# EAGLE design LED_strip_control (EAGLE 6.6.0)
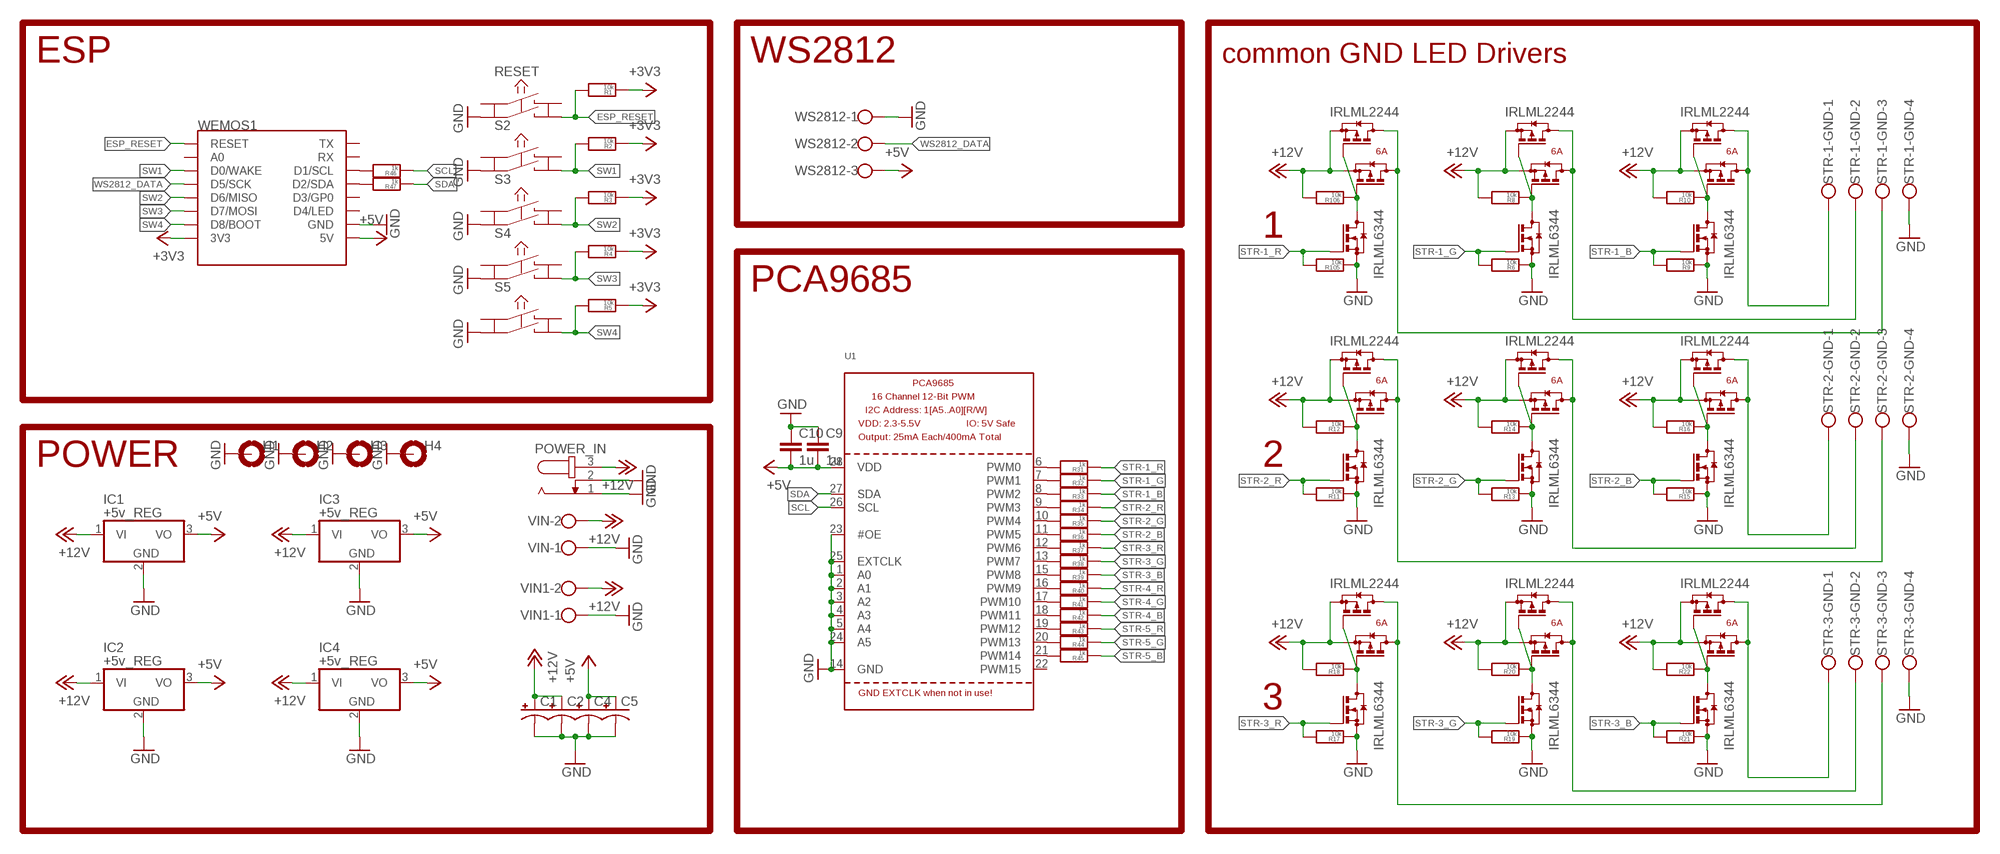
[diagram p0: schematic, sheet 1, part 1 of 2]
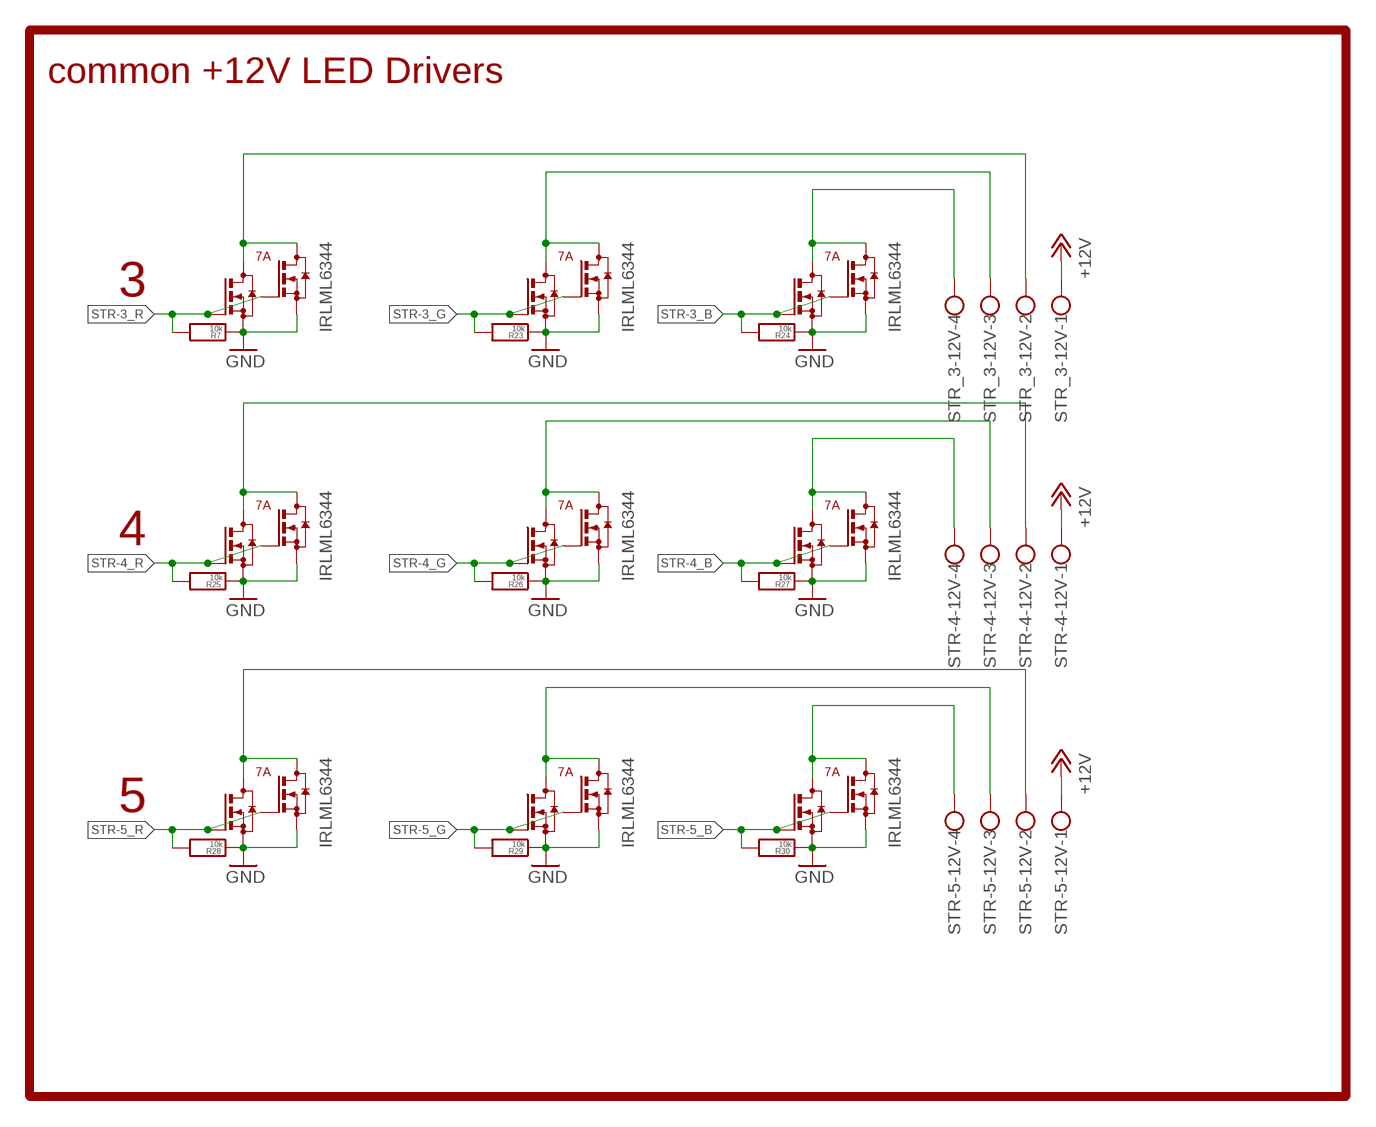
[diagram p1: schematic, sheet 1, part 2 of 2]

## Parts
C1  CPOL-USE5-10.5  [E5-10,5@1]
C2  CPOL-USE5-10.5  [E5-10,5@1]
C4  CPOL-USE5-10.5  [E5-10,5@1]
C5  CPOL-USE5-10.5  [E5-10,5@1]
C9  1u  C-EUC0805  [C0805]
C10  1u  C-EUC0805  [C0805]
H1  MOUNT-PAD-ROUND3.2  [3,2-PAD]
H2  MOUNT-PAD-ROUND3.2  [3,2-PAD]
H3  MOUNT-PAD-ROUND3.2  [3,2-PAD]
H4  MOUNT-PAD-ROUND3.2  [3,2-PAD]
IC1  +5v_REG  786TV  [TO220V]
IC2  +5v_REG  786TV  [TO220V]
IC3  +5v_REG  786TV  [TO220V]
IC4  +5v_REG  786TV  [TO220V]
POWER_IN  RAPC7120  [RAPC712]
Q1  IRLML2244  BSS84  [SOT23]
Q2  IRLML2244  BSS84  [SOT23]
Q3  IRLML6344  BSS123  [SOT23]
Q4  IRLML6344  BSS123  [SOT23]
Q5  IRLML6344  BSS123  [SOT23]
Q6  IRLML6344  BSS123  [SOT23]
Q7  IRLML2244  BSS84  [SOT23]
Q8  IRLML2244  BSS84  [SOT23]
Q9  IRLML6344  BSS123  [SOT23]
Q10  IRLML2244  BSS84  [SOT23]
Q11  IRLML2244  BSS84  [SOT23]
Q12  IRLML6344  BSS123  [SOT23]
Q13  IRLML2244  BSS84  [SOT23]
Q14  IRLML2244  BSS84  [SOT23]
Q15  IRLML6344  BSS123  [SOT23]
Q16  IRLML2244  BSS84  [SOT23]
Q17  IRLML2244  BSS84  [SOT23]
Q18  IRLML6344  BSS123  [SOT23]
Q19  IRLML2244  BSS84  [SOT23]
Q20  IRLML2244  BSS84  [SOT23]
Q21  IRLML6344  BSS123  [SOT23]
Q22  IRLML2244  BSS84  [SOT23]
Q23  IRLML2244  BSS84  [SOT23]
Q24  IRLML6344  BSS123  [SOT23]
Q25  IRLML2244  BSS84  [SOT23]
Q26  IRLML2244  BSS84  [SOT23]
Q27  IRLML6344  BSS123  [SOT23]
Q28  IRLML2244  BSS84  [SOT23]
Q29  IRLML2244  BSS84  [SOT23]
Q30  IRLML6344  BSS123  [SOT23]
Q31  IRLML6344  BSS123  [SOT23]
Q32  IRLML6344  BSS123  [SOT23]
Q33  IRLML6344  BSS123  [SOT23]
Q34  IRLML6344  BSS123  [SOT23]
Q35  IRLML6344  BSS123  [SOT23]
Q36  IRLML6344  BSS123  [SOT23]
Q37  IRLML6344  BSS123  [SOT23]
Q38  IRLML6344  BSS123  [SOT23]
Q39  IRLML6344  BSS123  [SOT23]
Q40  IRLML6344  BSS123  [SOT23]
Q41  IRLML6344  BSS123  [SOT23]
Q42  IRLML6344  BSS123  [SOT23]
Q43  IRLML6344  BSS123  [SOT23]
Q44  IRLML6344  BSS123  [SOT23]
Q45  IRLML6344  BSS123  [SOT23]
R1  10k  R-EU_R0805  [R0805]
R2  10k  R-EU_R0805  [R0805]
R3  10k  R-EU_R0805  [R0805]
R4  10k  R-EU_R0805  [R0805]
R5  10k  R-EU_R0805  [R0805]
R6  10k  R-EU_R0805  [R0805]
R7  10k  R-EU_R0805  [R0805]
R8  10k  R-EU_R0805  [R0805]
R9  10k  R-EU_R0805  [R0805]
R10  10k  R-EU_R0805  [R0805]
R11  10k  R-EU_R0805  [R0805]
R12  10k  R-EU_R0805  [R0805]
R13  10k  R-EU_R0805  [R0805]
R14  10k  R-EU_R0805  [R0805]
R15  10k  R-EU_R0805  [R0805]
R16  10k  R-EU_R0805  [R0805]
R17  10k  R-EU_R0805  [R0805]
R18  10k  R-EU_R0805  [R0805]
R19  10k  R-EU_R0805  [R0805]
R20  10k  R-EU_R0805  [R0805]
R21  10k  R-EU_R0805  [R0805]
R22  10k  R-EU_R0805  [R0805]
R23  10k  R-EU_R0805  [R0805]
R24  10k  R-EU_R0805  [R0805]
R25  10k  R-EU_R0805  [R0805]
R26  10k  R-EU_R0805  [R0805]
R27  10k  R-EU_R0805  [R0805]
R28  10k  R-EU_R0805  [R0805]
R29  10k  R-EU_R0805  [R0805]
R30  10k  R-EU_R0805  [R0805]
R31  1k  R-EU_R0805  [R0805]
R32  1k  R-EU_R0805  [R0805]
R33  1k  R-EU_R0805  [R0805]
R34  1k  R-EU_R0805  [R0805]
R35  1k  R-EU_R0805  [R0805]
R36  1k  R-EU_R0805  [R0805]
R37  1k  R-EU_R0805  [R0805]
R38  1k  R-EU_R0805  [R0805]
R39  1k  R-EU_R0805  [R0805]
R40  1k  R-EU_R0805  [R0805]
R41  1k  R-EU_R0805  [R0805]
R42  1k  R-EU_R0805  [R0805]
R43  1k  R-EU_R0805  [R0805]
R44  1k  R-EU_R0805  [R0805]
R45  1k  R-EU_R0805  [R0805]
R46  1k  R-EU_R0805  [R0805]
R47  1k  R-EU_R0805  [R0805]
R105  10k  R-EU_R0805  [R0805]
R106  10k  R-EU_R0805  [R0805]
RESET  KSM611A  [KSM611A]
S2  KSM611A  [KSM611A]
S3  KSM611A  [KSM611A]
S4  KSM611A  [KSM611A]
S5  KSM611A  [KSM611A]
STR-1-GND  KLEMME_4-PIN  [KLEMME_4-PIN]
STR-2-GND  KLEMME_4-PIN  [KLEMME_4-PIN]
STR-3-GND  KLEMME_4-PIN  [KLEMME_4-PIN]
STR-4-12V  KLEMME_4-PIN  [KLEMME_4-PIN]
STR-5-12V  KLEMME_4-PIN  [KLEMME_4-PIN]
STR_3-12V  KLEMME_4-PIN  [KLEMME_4-PIN]
U1  PCA9685  [TSSOP28]
VIN  W237-102  [W237-102]
VIN1  W237-102  [W237-102]
WEMOS1  WEMOS-D1-MINI  [WEMOS-D1-MINI]
WS2812  KLEMME_3-PIN  [KLEMME_3-PIN]

## Nets
+3V3: R1.1 R2.1 R3.1 R4.1 R5.1 WEMOS1.3V3
+5V: C4.+ C5.+ C9.2 C10.2 IC1.3(VO) IC2.3(VO) IC3.3(VO) IC4.3(VO) U1.28(VDD) WEMOS1.5V WS2812.3
+12V: C1.+ C2.+ IC1.1(VI) IC2.1(VI) IC3.1(VI) IC4.1(VI) POWER_IN.3 Q1.2(S) Q2.2(S) Q7.2(S) Q8.2(S) Q10.2(S) Q11.2(S) Q13.2(S) Q14.2(S) Q16.2(S) Q17.2(S) Q19.2(S) Q20.2(S) Q22.2(S) Q23.2(S) Q25.2(S) Q26.2(S) Q28.2(S) Q29.2(S) R8.2 R10.2 R12.2 R14.2 R16.2 R18.2 R20.2 R22.2 R106.2 STR-4-12V.1 STR-5-12V.1 STR_3-12V.1 VIN1.2 VIN.2
ESP_RESET: R1.2 RESET.D WEMOS1.RESET
GND: C1.- C2.- C4.- C5.- C9.1 C10.1 H1.B3,2(MOUNT) H2.B3,2(MOUNT) H3.B3,2(MOUNT) H4.B3,2(MOUNT) IC1.2(GND) IC2.2(GND) IC3.2(GND) IC4.2(GND) POWER_IN.1 POWER_IN.2 Q3.2(S) Q4.2(S) Q5.2(S) Q6.2(S) Q9.2(S) Q12.2(S) Q15.2(S) Q18.2(S) Q21.2(S) Q24.2(S) Q27.2(S) Q30.2(S) Q31.2(S) Q32.2(S) Q33.2(S) Q34.2(S) Q35.2(S) Q36.2(S) Q37.2(S) Q38.2(S) Q39.2(S) Q40.2(S) Q41.2(S) Q42.2(S) Q43.2(S) Q44.2(S) Q45.2(S) R6.1 R7.1 R9.1 R11.1 R13.1 R15.1 R17.1 R19.1 R21.1 R23.1 R24.1 R25.1 R26.1 R27.1 R28.1 R29.1 R30.1 R105.1 RESET.C S2.C S3.C S4.C S5.C STR-1-GND.4 STR-2-GND.4 STR-3-GND.4 U1.1(A0) U1.2(A1) U1.3(A2) U1.4(A3) U1.5(A4) U1.14(GND) U1.23(#OE) U1.24(A5) U1.25(EXTCLK) VIN1.1 VIN.1 WEMOS1.GND WS2812.1
N$1: Q12.3(D) Q13.1(G) Q14.1(G) R12.1
N$2: Q1.3(D) Q2.3(D) STR-1-GND.3
N$3: Q6.3(D) Q7.1(G) Q8.1(G) R8.1
N$4: Q3.3(D) Q5.3(D) STR_3-12V.2
N$5: Q34.3(D) Q35.3(D) STR-4-12V.2
N$6: Q13.3(D) Q14.3(D) STR-2-GND.3
N$7: Q7.3(D) Q8.3(D) STR-1-GND.2
N$8: Q9.3(D) Q10.1(G) Q11.1(G) R10.1
N$9: Q15.3(D) Q16.1(G) Q17.1(G) R14.1
N$10: Q10.3(D) Q11.3(D) STR-1-GND.1
N$11: Q16.3(D) Q17.3(D) STR-2-GND.2
N$12: Q18.3(D) Q19.1(G) Q20.1(G) R16.1
N$13: Q19.3(D) Q20.3(D) STR-2-GND.1
N$14: Q21.3(D) Q22.1(G) Q23.1(G) R18.1
N$15: Q22.3(D) Q23.3(D) STR-3-GND.3
N$16: Q24.3(D) Q25.1(G) Q26.1(G) R20.1
N$17: Q25.3(D) Q26.3(D) STR-3-GND.2
N$18: Q27.3(D) Q28.1(G) Q29.1(G) R22.1
N$19: Q28.3(D) Q29.3(D) STR-3-GND.1
N$20: Q30.3(D) Q31.3(D) STR_3-12V.3
N$21: Q36.3(D) Q37.3(D) STR-4-12V.3
N$22: Q32.3(D) Q33.3(D) STR_3-12V.4
N$23: Q38.3(D) Q39.3(D) STR-4-12V.4
N$24: Q40.3(D) Q41.3(D) STR-5-12V.2
N$25: Q42.3(D) Q43.3(D) STR-5-12V.3
N$26: Q44.3(D) Q45.3(D) STR-5-12V.4
N$27: R31.2 U1.6(PWM0)
N$28: R32.2 U1.7(PWM1)
N$29: R45.2 U1.21(PWM14)
N$30: R44.2 U1.20(PWM13)
N$31: R43.2 U1.19(PWM12)
N$32: R42.2 U1.18(PWM11)
N$33: R41.2 U1.17(PWM10)
N$34: R40.2 U1.16(PWM9)
N$35: R39.2 U1.15(PWM8)
N$36: R38.2 U1.13(PWM7)
N$37: R37.2 U1.12(PWM6)
N$38: R36.2 U1.11(PWM5)
N$39: R35.2 U1.10(PWM4)
N$40: R34.2 U1.9(PWM3)
N$41: R33.2 U1.8(PWM2)
N$42: R46.2 WEMOS1.D1(D1/SCL)
N$43: R47.2 WEMOS1.D2(D2/SDA)
N$115: Q1.1(G) Q2.1(G) Q4.3(D) R106.1
SCL: R46.1 U1.26(SCL)
SDA: R47.1 U1.27(SDA)
STR-1_B: Q9.1(G) R9.2 R33.1
STR-1_G: Q6.1(G) R6.2 R32.1
STR-1_R: Q4.1(G) R31.1 R105.2
STR-2_B: Q18.1(G) R15.2 R36.1
STR-2_G: Q15.1(G) R13.2 R35.1
STR-2_R: Q12.1(G) R11.2 R34.1
STR-3_B: Q27.1(G) Q32.1(G) Q33.1(G) R21.2 R24.2 R39.1
STR-3_G: Q24.1(G) Q30.1(G) Q31.1(G) R19.2 R23.2 R38.1
STR-3_R: Q3.1(G) Q5.1(G) Q21.1(G) R7.2 R17.2 R37.1
STR-4_B: Q38.1(G) Q39.1(G) R27.2 R42.1
STR-4_G: Q36.1(G) Q37.1(G) R26.2 R41.1
STR-4_R: Q34.1(G) Q35.1(G) R25.2 R40.1
STR-5_B: Q44.1(G) Q45.1(G) R30.2 R45.1
STR-5_G: Q42.1(G) Q43.1(G) R29.2 R44.1
STR-5_R: Q40.1(G) Q41.1(G) R28.2 R43.1
SW1: R2.2 S2.D WEMOS1.D0(D0/WAKE)
SW2: R3.2 S3.D WEMOS1.D6(D6/MISO)
SW3: R4.2 S4.D WEMOS1.D7(D7/MOSI)
SW4: R5.2 S5.D WEMOS1.D8(D8/BOOT)
WS2812_DATA: WEMOS1.D5(D5/SCK) WS2812.2
Unconnected: RESET.A RESET.B S2.A S2.B S3.A S3.B S4.A S4.B S5.A S5.B U1.22(PWM15) WEMOS1.A0 WEMOS1.D3(D3/GP0) WEMOS1.D4(D4/LED) WEMOS1.RX WEMOS1.TX

## Notes on the sheet
- ESP | WS2812 | common GND LED Drivers | common +12V LED Drivers
- 6A | 6A | 6A
- 7A | 7A | 7A
- 3
- 1
- PCA9685
- 6A | 6A | 6A
- 7A | 7A | 7A
- 4
- POWER | 2
- 7A | 7A | 7A
- 5
- 6A | 6A | 6A
- 3

## Library data of the parts
C1 C2 C4 C5 = rcl:CPOL-US: POLARIZED CAPACITOR, American symbol
C9 C10 = rcl:C-EU: CAPACITOR, European symbol
H1-H4 = holes:MOUNT-PAD-ROUND: MOUNTING PAD, round
IC1-IC4 = linear:78*: Positive VOLTAGE REGULATOR Source: http://cache.national.com/ds/LM/LM78L05.pdf http://www.fairchildsemi.com/ds/LM/LM7805.pdf
POWER_IN = Arduino Mega 2560:RAPC712: DC POWER JACK Power Jack, DC, Right Angle, Through Hole, Rated 5A at 16VDC, PC Terminals Distributor: Farnell (www.Farnell.de) Drawing: 84N1161.pdf / 84N1162.pdf Manufacturer: SPC Technology (www.spctechnology.com) Type: SPC4077 / SPC 4078
Q1 Q2 Q7 Q8 Q10 Q11 Q13 Q14 Q16 Q17 Q19 Q20 Q22 Q23 Q25 Q26 Q28 Q29 = transistor-small-signal:BSS84: P-CHANNEL MOS FET
Q3-Q6 Q9 Q12 Q15 Q18 Q21 Q24 Q27 Q30-Q45 = transistor-small-signal:BSS123: N-CHANNEL MOS FET
R1-R47 R105 R106 = rcl:R-EU_: RESISTOR, European symbol
RESET S2-S5 = schalter_taster:KSM611A
STR-1-GND STR-2-GND STR-3-GND STR-4-12V STR-5-12V STR_3-12V = Schraubklemme:KLEMME_4-PIN
U1 = adafruit:PCA9685: PCA9685 - 16 Channel 12-Bit I2C PWM Controller 5.0V tolerant 16 channel, 12-bit I2C PWM controller with 25mA per output (max. 400mA total) Digikey: 568-5931-1-ND
VIN VIN1 = Schraubklemme:W237-102: WAGO SCREW CLAMP; MPN: 237-102; OC_FARNELL: unknown; OC_NEWARK: 70K9898
WEMOS1 = esp8266modules:WEMOS-D1-MINI: WeMos.cc D1 mini ESP8266 module
WS2812 = Schraubklemme:KLEMME_3-PIN

## Net classes
1 5v: width 0.813 mm, drill 0.8 mm
2 power: width 0.406 mm, drill 0.5 mm, clearance 0.15 mm

## Board
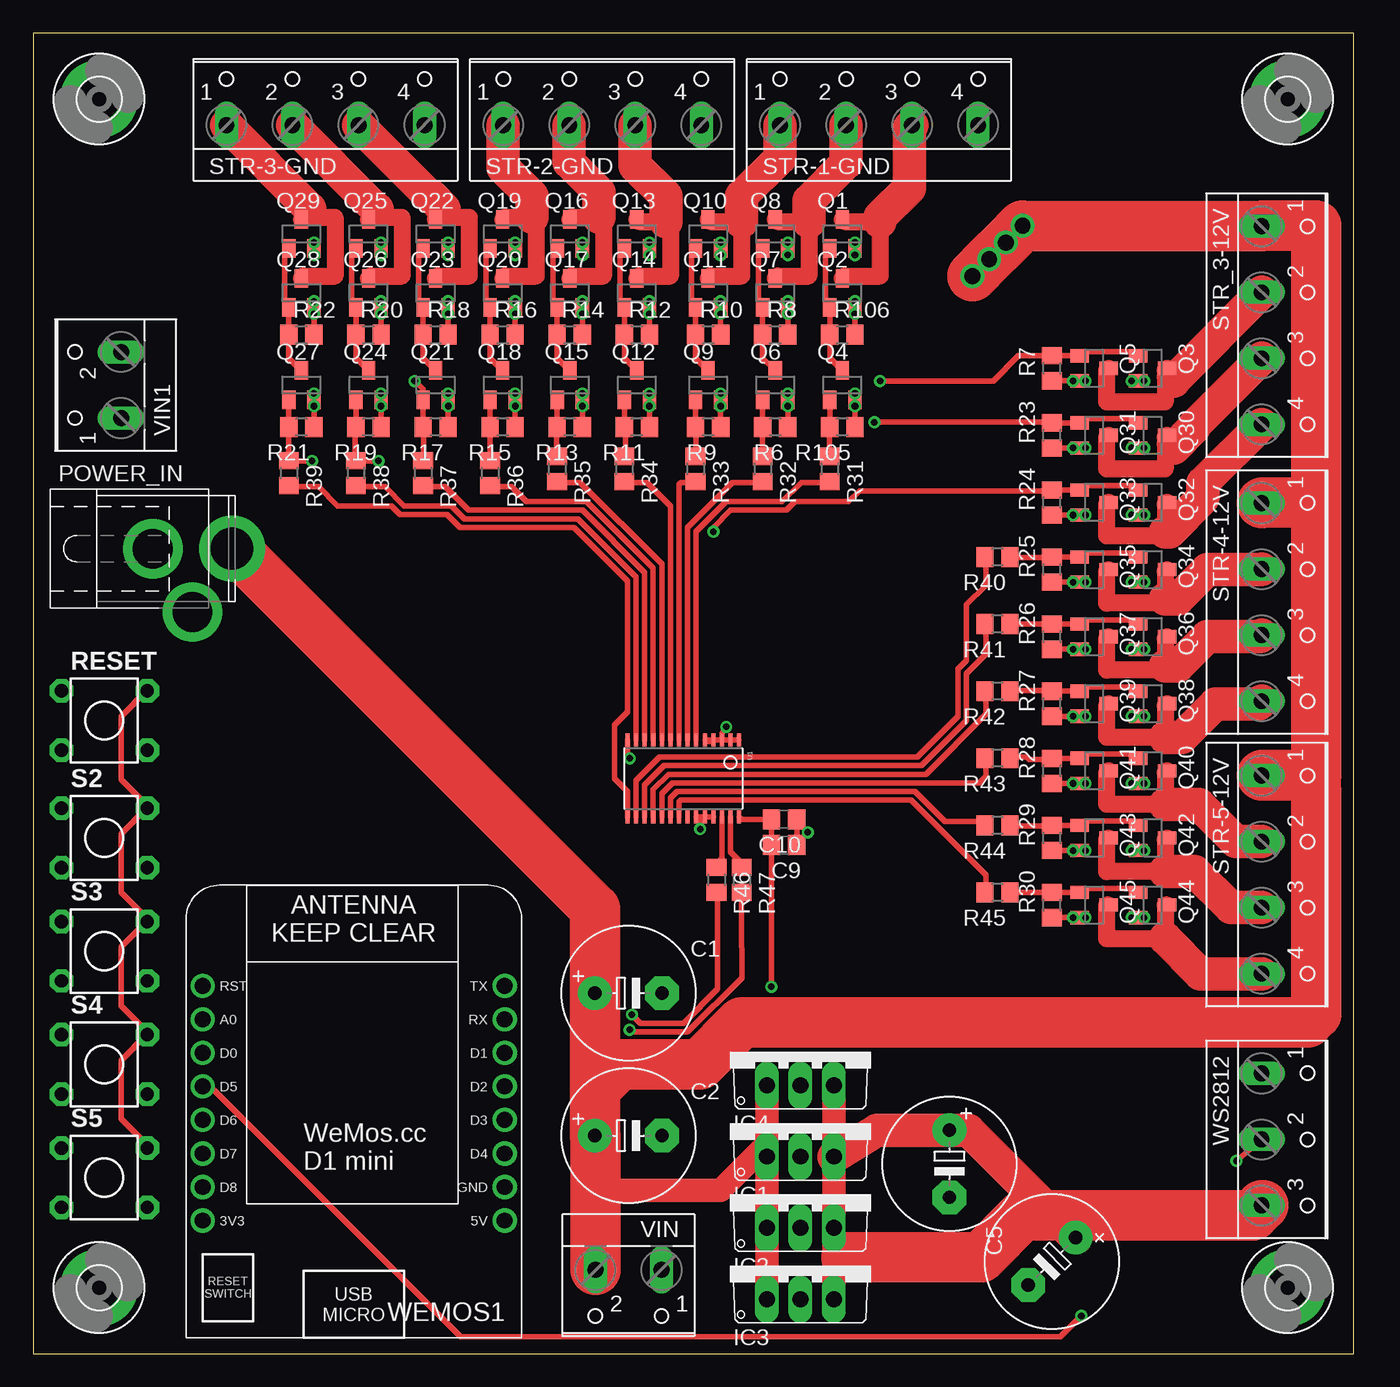
[diagram p2: board, top side]
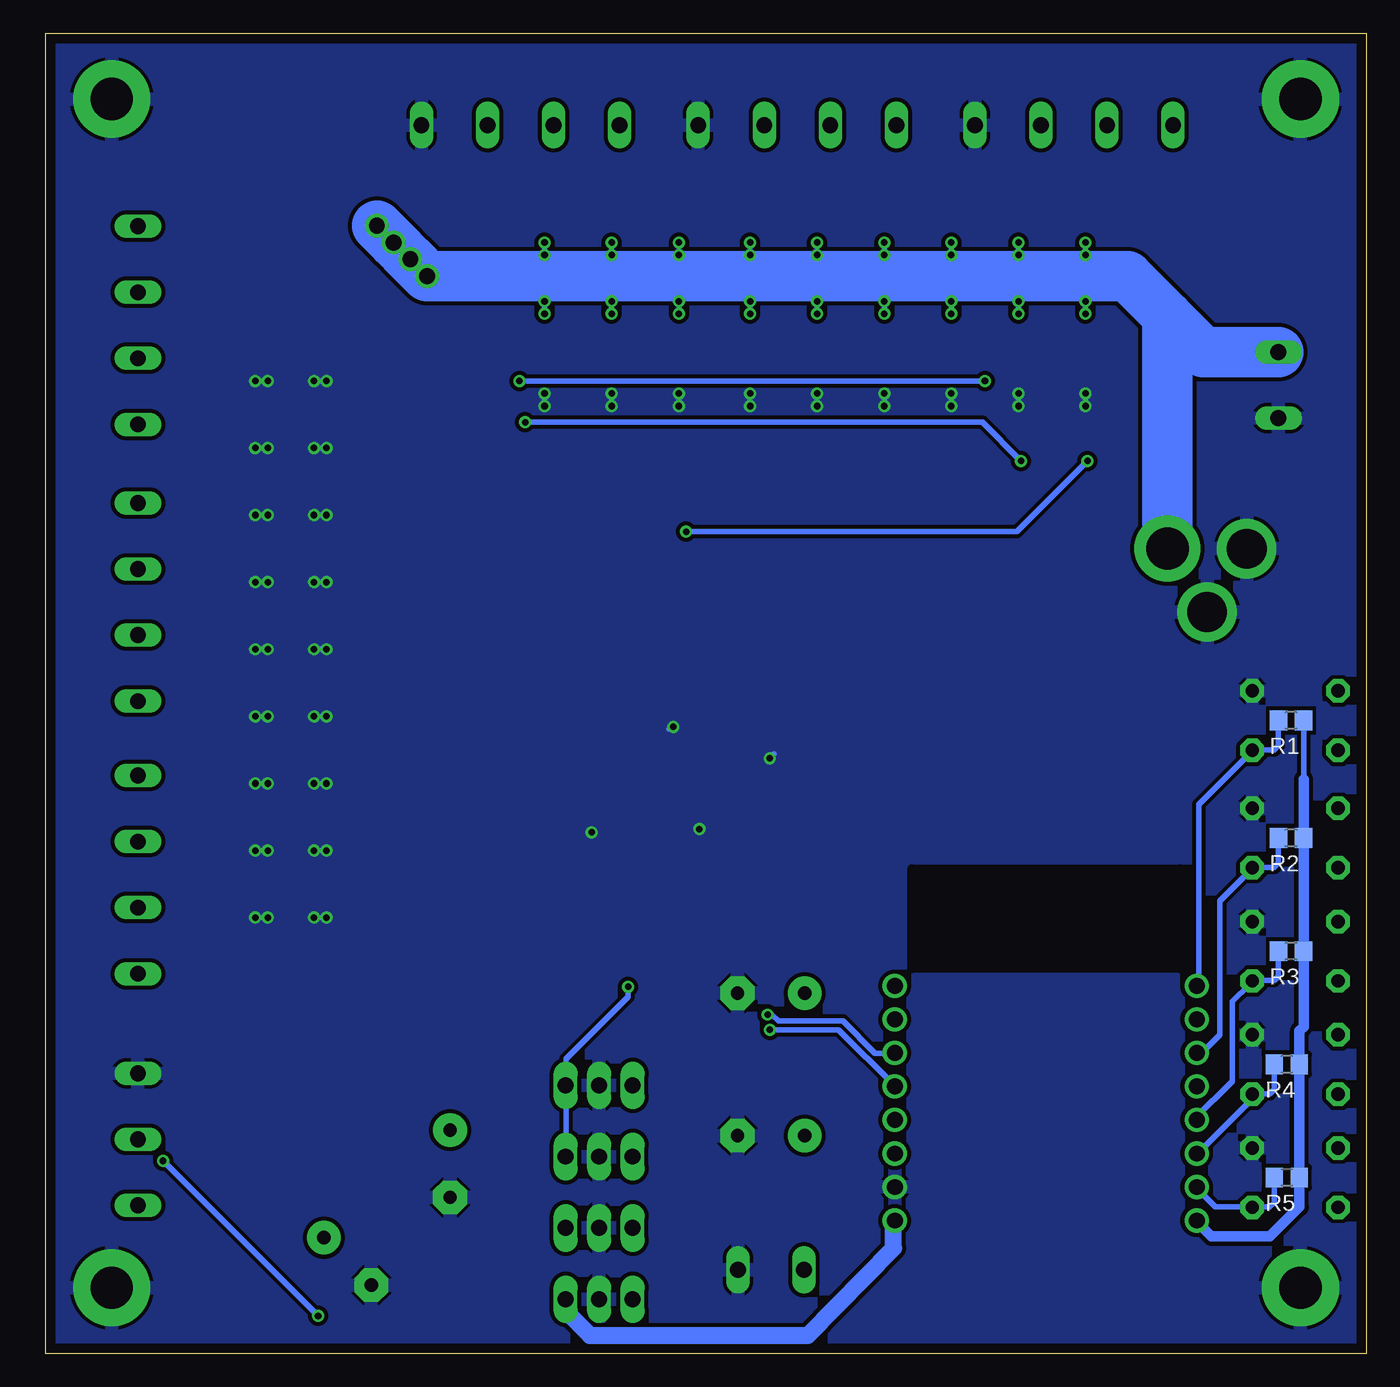
[diagram p3: board, bottom side, seen from below]

Size 100 x 100 mm. Coordinates in mm from the lower left corner, seen from the top.
Outline: 0,0 100,0 100,100 0,100 0,0
Copper layers (1*16): Top 0.035mm / dielectric 1.5mm / Bottom 0.035mm
Design rules "default *": minimum track width 10mil, minimum drill 19mil, track to track 8mil, track to pad 8mil, pad to pad 8mil, via to via 8mil, smd to smd 0mil, copper to edge 30mil, drill to drill 8mil, minimum pad ring 10mil, minimum via ring 8mil, stop-mask expansion 4mil, vias tented up to drill 25mil, thermal gap 10mil

### Footprints (pad centres in the part's own frame; a part is rotated, then mirrored left to right if it is on the bottom)
E5-10,5@1 = drill 1.016 pad 2.54: + -2.54,0 | drill 1.016 pad 2.54 octagon: - 2.54,0
C0805 = smd 1.3 x 1.5: 1 -0.95,0; 2 0.95,0
3,2-PAD = drill 3.2 pad 5.842: B3,2 0,0
TO220V = drill 1.2 long: 1 -2.54,-2.54; 2 0,-2.54; 3 2.54,-2.54
RAPC712 = drill 3 pad 4.5: 1 -3,0; 2 0,-4.8 | drill 3.2 pad 5: 3 3,0
SOT23 = smd 1 x 1.4: 1 -0.95,-1.1; 2 0.95,-1.1; 3 0,1.1
R0805 = smd 1.3 x 1.5: 1 -0.95,0; 2 0.95,0
KSM611A = drill 1.016 pad 1.778 octagon: A -3.25,2.25; B -3.25,-2.25; C 3.25,2.25; D 3.25,-2.25
KLEMME_4-PIN = drill 1.194 long: 1 -2.5,0; 2 2.5,0; 3 7.5,0; 4 12.5,0
TSSOP28 = smd 0.305 x 0.991: 1 -4.225,-2.918; 2 -3.575,-2.918; 3 -2.925,-2.918; 4 -2.275,-2.918; 5 -1.625,-2.918; 6 -0.975,-2.918; 7 -0.325,-2.918; 8 0.325,-2.918; 9 0.975,-2.918; 10 1.625,-2.918; 11 2.275,-2.918; 12 2.925,-2.918; 13 3.575,-2.918; 14 4.225,-2.918; 15 4.225,2.918; 16 3.575,2.918; 17 2.925,2.918; 18 2.275,2.918; 19 1.625,2.918; 20 0.975,2.918; 21 0.325,2.918; 22 -0.325,2.918; 23 -0.975,2.918; 24 -1.625,2.918; 25 -2.275,2.918; 26 -2.925,2.918; 27 -3.575,2.918; 28 -4.225,2.918
W237-102 = drill 1.194 long: 1 -2.5,-1.27; 2 2.5,-1.27
WEMOS-D1-MINI = drill 1.2 pad 1.829: 3V3 -10.16,-10.16; 5V 12.7,-10.16; A0 -10.16,5.08; D0 -10.16,2.54; D1 12.7,2.54; D2 12.7,0; D3 12.7,-2.54; D4 12.7,-5.08; D5 -10.16,0; D6 -10.16,-2.54; D7 -10.16,-5.08; D8 -10.16,-7.62; GND 12.7,-7.62; RESET -10.16,7.62; RX 12.7,5.08; TX 12.7,7.62
KLEMME_3-PIN = drill 1.194 long: 1 -2.5,0; 2 2.5,0; 3 7.5,0

### Placement (x,y rotation side)
C1  45.09,27.3 0 top
C2  45.09,16.51 0 top
C4  77.15,6.99 225 top
C5  69.39,14.38 270 top
C9  56.88,38.51 180 top
C10  56.88,40.46 180 top
H1  5,5 0 top
H2  95,5 0 top
H3  5,95 0 top
H4  95,95 0 top
IC1  58.1,17.46 0 top
IC2  58.1,12.06 0 top
IC3  58.1,6.67 0 top
IC4  58.1,22.86 0 top
POWER_IN  12.06,60.96 0 top
Q1  61.28,84.77 0 top
Q2  61.28,80.33 0 top
Q3  84.77,74.61 270 top
Q4  61.28,73.34 0 top
Q5  80.33,74.61 270 top
Q6  56.2,73.34 0 top
Q7  56.2,80.33 0 top
Q8  56.2,84.77 0 top
Q9  51.12,73.34 0 top
Q10  51.12,84.77 0 top
Q11  51.12,80.33 0 top
Q12  45.72,73.34 0 top
Q13  45.72,84.77 0 top
Q14  45.72,80.33 0 top
Q15  40.64,73.34 0 top
Q16  40.64,84.77 0 top
Q17  40.64,80.33 0 top
Q18  35.56,73.34 0 top
Q19  35.56,84.77 0 top
Q20  35.56,80.33 0 top
Q21  30.48,73.34 0 top
Q22  30.48,84.77 0 top
Q23  30.48,80.33 0 top
Q24  25.4,73.34 0 top
Q25  25.4,84.77 0 top
Q26  25.4,80.33 0 top
Q27  20.32,73.34 0 top
Q28  20.32,80.33 0 top
Q29  20.32,84.77 0 top
Q30  84.77,69.53 270 top
Q31  80.33,69.53 270 top
Q32  84.77,64.45 270 top
Q33  80.33,64.45 270 top
Q34  84.77,59.37 270 top
Q35  80.33,59.37 270 top
Q36  84.77,54.29 270 top
Q37  80.33,54.29 270 top
Q38  84.77,49.21 270 top
Q39  80.33,49.21 270 top
Q40  84.77,44.13 270 top
Q41  80.33,44.13 270 top
Q42  84.77,39.05 270 top
Q43  80.33,39.05 270 top
Q44  84.77,33.97 270 top
Q45  80.33,33.97 270 top
R1  5.71,47.94 180 bottom
R2  5.71,39.05 180 bottom
R3  5.71,30.48 180 bottom
R4  6.03,21.91 180 bottom
R5  6.03,13.34 180 bottom
R6  56.2,70.17 180 top
R7  77.15,74.61 90 top
R8  56.2,77.15 0 top
R9  51.12,70.17 180 top
R10  51.12,77.15 0 top
R11  45.72,70.17 180 top
R12  45.72,77.15 0 top
R13  40.64,70.17 180 top
R14  40.64,77.15 0 top
R15  35.56,70.17 180 top
R16  35.56,77.15 0 top
R17  30.48,70.17 180 top
R18  30.48,77.15 0 top
R19  25.4,70.17 180 top
R20  25.4,77.15 0 top
R21  20.32,70.17 180 top
R22  20.32,77.15 0 top
R23  77.15,69.53 90 top
R24  77.15,64.45 90 top
R25  77.15,59.37 90 top
R26  77.15,54.29 90 top
R27  77.15,49.21 90 top
R28  77.15,44.13 90 top
R29  77.15,39.05 90 top
R30  77.15,33.97 90 top
R31  60.33,66.99 270 top
R32  55.24,66.99 270 top
R33  50.16,66.99 270 top
R34  44.77,66.99 270 top
R35  39.69,66.99 270 top
R36  34.61,66.67 270 top
R37  29.53,66.67 270 top
R38  24.45,66.67 270 top
R39  19.37,66.67 270 top
R40  73.03,60.33 180 top
R41  73.03,55.24 180 top
R42  73.03,50.16 180 top
R43  73.03,45.09 180 top
R44  73.03,40.01 180 top
R45  73.03,34.92 180 top
R46  51.75,35.88 270 top
R47  53.66,35.88 270 top
R105  61.28,70.17 180 top
R106  61.28,77.15 0 top
RESET  5.4,47.94 0 top
S2  5.4,39.05 0 top
S3  5.4,30.48 0 top
S4  5.4,21.91 0 top
S5  5.4,13.34 0 top
STR-1-GND  59.05,93.03 0 top
STR-2-GND  38.1,93.03 0 top
STR-3-GND  17.14,93.03 0 top
STR-4-12V  93.03,61.91 270 top
STR-5-12V  93.03,41.27 270 top
STR_3-12V  93.03,82.87 270 top
U1  49.24,43.55 180 top
VIN  45.09,5.08 180 top
VIN1  5.4,73.34 90 top
WEMOS1  23.02,20.24 0 top
WS2812  93.03,18.73 270 top

### Tracks (layer width: path | path; a pad name or v marks a point on that pad's centre or on a via)
+3V3
  Bottom 0.406: 4.76,43.5 R1.1 | R2.1 | R3.1 | R4.1 | R5.1
  Bottom 0.813: 4.76,43.5 R2.1 R3.1 4.76,24.77 5.08,24.45 R4.1 R5.1 5.08,11.11 7.3,8.89 11.75,8.89 12.7,9.84 WEMOS1.3V3
+5V  (via drill 0.5)
  Top 0.406: U1.28 53.63,40.46 C10.2 C9.2 55.9,38.35 v55.9,27.79
  Top 1.27: 61.59,7.3 60.64,8.26
  Top 1.778: IC3.3 60.64,8.26 IC2.3 IC1.3 | IC1.3 60.73,16.92 | IC4.3 IC1.3
  Top 2.54: IC1.3 63.91,16.92 C5.+ 70.81,16.92 C4.+
  Top 3.81: WS2812.3 93.15,11.23 92.39,10.48 74.93,10.48 71.75,7.3 61.59,7.3
  Bottom 0.406: v55.9,27.79 55.9,27.02 60.61,22.31 60.61,16.9 IC1.3
  Bottom 1.27: WEMOS1.5V 35.81,10.03 35.81,8 42.29,1.4 58.8,1.4 60.58,3.17 60.58,4.06 IC3.3
+12V  (via drill 0.5, 1.2)
  Top 0.406: R106.2 Q2.2 v62.23,78.74 | R8.2 Q7.2 v57.15,78.74 | R10.2 Q11.2 v52.07,78.74 | R12.2 Q14.2 v46.67,78.74 | R14.2 Q17.2 v41.59,78.74 | R16.2 Q20.2 v36.51,78.74 | R18.2 Q23.2 v31.43,78.74 | R20.2 Q26.2 v26.35,78.74 | R22.2 Q28.2 v21.27,78.74 | v21.27,79.69 21.27,79.38 | v26.35,79.69 26.35,79.38 | v31.43,79.69 31.43,79.38 | v36.51,79.69 36.51,79.38 | v41.59,79.69 41.59,79.38 | v46.67,79.69 46.67,79.38 | v52.07,79.69 52.07,79.38 | v57.15,79.69 57.15,79.38 | v62.23,79.69 62.23,79.38 | Q29.2 v21.27,83.19 | v21.27,84.14 21.27,83.82 | Q25.2 v26.35,83.19 | v26.35,84.14 26.35,83.82 | Q22.2 v31.43,83.19 | v31.43,84.14 31.43,83.82 | Q19.2 v36.51,83.19 | v36.51,84.14 36.51,83.82 | Q16.2 v41.59,83.19 | v41.59,84.14 41.59,83.82 | Q13.2 v46.67,83.19 | v46.67,84.14 46.67,83.82 | Q10.2 v52.07,83.19 | v52.07,84.14 52.07,83.82 | Q8.2 v57.15,83.19 | v57.15,84.14 57.15,83.82 | Q1.2 v62.23,83.19 | v62.23,84.14 62.23,83.82
  Top 1.778: IC1.1 IC2.1 IC3.1 | IC1.1 55.56,15.88 52.07,12.38 42.9,12.38 42.59,12.7 | IC4.1 IC1.1
  Top 3.81: STR-4-12V.1 93.07,64.45 97.16,64.45 | 97.16,64.45 97.16,85.41 93.07,85.41 STR_3-12V.1 74.89,85.37 v74.93,85.41 v73.66,84.14 v72.39,82.87 v71.12,81.6 | 97.16,43.81 93.07,43.81 STR-5-12V.1 97.11,43.77 | 97.16,43.81 97.16,64.45 | 42.55,20 C2.+ 42.59,16.47 42.59,12.7 VIN.2 | 97.11,43.77 97.16,43.81 | 97.11,43.77 97.16,41.91 97.16,25.72 96.52,25.08 53.66,25.08 50.48,21.91 44.45,21.91 42.55,20 | 42.55,20 C1.+ 42.55,33.67 15.11,61.1
  Bottom 0.406: v21.27,78.74 v21.27,79.69 21.59,81.6 | v26.35,78.74 v26.35,79.69 26.67,81.6 v26.35,83.19 v26.35,84.14 | v31.43,78.74 v31.43,79.69 31.75,81.6 v31.43,83.19 v31.43,84.14 | v36.51,78.74 v36.51,79.69 36.83,81.6 v36.51,83.19 v36.51,84.14 | v41.59,78.74 v41.59,79.69 41.91,81.6 v41.59,83.19 v41.59,84.14 | v46.67,78.74 v46.67,79.69 46.99,81.6 v46.67,83.19 v46.67,84.14 | v52.07,78.74 v52.07,79.69 52.39,81.6 v52.07,83.19 v52.07,84.14 | v62.23,78.74 v62.23,79.69 62.23,81.6 v62.23,83.19 v62.23,84.14 | v21.27,84.14 v21.27,83.19 21.27,81.6 | v57.15,84.14 v57.15,83.19 57.15,81.6 v57.15,79.69 v57.15,78.74
  Bottom 3.81: v71.12,81.6 v72.39,82.87 | v73.66,84.14 73.98,84.45 | v74.93,85.41 v71.12,81.6 | v71.12,81.6 62.23,81.6 57.15,81.6 52.39,81.6 46.99,81.6 41.91,81.6 36.83,81.6 31.75,81.6 26.67,81.6 21.59,81.6 21.27,81.6 18.1,81.6 15.06,78.56 | POWER_IN.3 15.06,78.56 | VIN1.2 12.34,75.84 15.06,78.56
ESP_RESET
  Bottom 0.406: R1.2 6.67,46.04 6.99,45.72 8.57,45.72 RESET.D 8.89,45.4 12.7,41.59 12.7,27.94 WEMOS1.RESET
GND  (via drill 0.5)
  Top 0.406: R30.1 Q45.2 v78.74,33.02 | R7.1 Q5.2 v78.74,73.66 | R23.1 Q31.2 v78.74,68.58 | R24.1 Q33.2 v78.74,63.5 | R25.1 Q35.2 v78.74,58.42 | R26.1 Q37.2 v78.74,53.34 | R27.1 Q39.2 v78.74,48.26 | R28.1 Q41.2 v78.74,43.18 | R29.1 Q43.2 | Q43.2 79.06,37.93 | Q42.2 v83.19,38.1 | v84.14,38.1 83.82,38.1 | Q43.2 v78.74,38.1 | v79.69,38.1 79.38,38.1 | v79.69,33.02 79.38,33.02 | Q44.2 v83.19,33.02 | v84.14,33.02 83.82,33.02 | v79.69,43.18 79.38,43.18 | Q40.2 v83.19,43.18 | v84.14,43.18 83.82,43.18 | v79.69,48.26 79.38,48.26 | Q38.2 v83.19,48.26 | v84.14,48.26 83.82,48.26 | v79.69,53.34 79.38,53.34 | Q36.2 v83.19,53.34 | v84.14,53.34 83.82,53.34 | v79.69,58.42 79.38,58.42 | Q34.2 v83.19,58.42 | v84.14,58.42 83.82,58.42 | v79.69,63.5 79.38,63.5 | Q32.2 v83.19,63.5 | v84.14,63.5 83.82,63.5 | v79.69,68.58 79.38,68.58 | Q30.2 v83.19,68.58 | v84.14,68.58 83.82,68.58 | v79.69,73.66 79.38,73.66 | Q3.2 v83.19,73.66 | v84.14,73.66 83.82,73.66 | R105.1 Q4.2 v62.23,71.75 | R6.1 Q6.2 v57.15,71.75 | R9.1 Q9.2 v52.07,71.75 | R11.1 Q12.2 v46.67,71.75 | R13.1 Q15.2 v41.59,71.75 | R15.1 Q18.2 v36.51,71.75 | R17.1 Q21.2 v31.43,71.75 | R19.1 Q24.2 v26.35,71.75 | R21.1 Q27.2 | Q27.2 v21.27,71.75 | v21.27,72.71 Q27.2 | v26.35,72.71 26.35,72.39 | v31.43,72.71 31.43,72.39 | v36.51,72.71 36.51,72.39 | v41.59,72.71 41.59,72.39 | v46.67,72.71 46.67,72.39 | v52.07,72.71 52.07,72.39 | v57.15,72.71 57.15,72.39 | v62.23,72.71 62.23,72.39 | U1.23 U1.24 U1.25 51.53,40.64 50.52,40.64 v50.52,39.72 | U1.3 U1.4 U1.5 51,46.35 51.53,46.35 | U1.3 U1.2 U1.1 | U1.14 45.01,45.5 v45.19,45.09 | RESET.C 8.57,50.16 6.67,48.26 6.67,43.5 8.57,41.59 S2.C 8.57,41.27 6.67,39.37 6.67,34.92 8.57,33.02 S3.C 8.57,32.7 6.67,30.8 6.67,26.35 8.57,24.45 S4.C 8.57,24.13 6.67,22.23 6.67,17.78 8.57,15.88 S5.C
  Top 0.406: U1.3 52.16,46.96 v52.49,47.47 | C9.1 C10.1 57.83,40.33 v58.66,39.49
  Bottom 0.406: v83.19,38.1 v84.14,38.1 | v78.74,38.1 v79.69,38.1 | v78.74,33.02 v79.69,33.02 | v83.19,33.02 v84.14,33.02 | v78.74,43.18 v79.69,43.18 | v83.19,43.18 v84.14,43.18 | v78.74,48.26 v79.69,48.26 | v83.19,48.26 v84.14,48.26 | v78.74,53.34 v79.69,53.34 | v83.19,53.34 v84.14,53.34 | v78.74,58.42 v79.69,58.42 | v83.19,58.42 v84.14,58.42 | v78.74,63.5 v79.69,63.5 | v83.19,63.5 v84.14,63.5 | v78.74,68.58 v79.69,68.58 | v83.19,68.58 v84.14,68.58 | v78.74,73.66 v79.69,73.66 | v83.19,73.66 v84.14,73.66 | v21.27,71.75 v21.27,72.71 | v26.35,71.75 v26.35,72.71 | v31.43,71.75 v31.43,72.71 | v36.51,71.75 v36.51,72.71 | v41.59,71.75 v41.59,72.71 | v46.67,71.75 v46.67,72.71 | v52.07,71.75 v52.07,72.71 | v57.15,71.75 v57.15,72.71 | v62.23,71.75 v62.23,72.71 | v45.19,45.09 44.87,45.4 | v52.49,47.47 52.8,47.31 | v58.66,39.49 58.83,39.49
  pour Bottom (isolate 0.305, rank 6): -2.86,102.23 101.28,101.92 101.28,-1.91 -2.86,-1.59
N$1
  Top 0.406: Q12.3 44.77,75.39 R12.1 Q14.1 44.77,79.37 44.45,79.69 44.45,83.35 Q13.1
N$2
  Top 1.27: Q2.3 61.45,81.6 64.14,81.6 64.14,85.72 61.42,85.72 Q1.3
  Top 2.54: STR-1-GND.3 66.36,92.83 66.36,88.27 64.14,86.04 64.14,85.72
N$3
  Top 0.406: Q6.3 55.25,75.39 R8.1 Q7.1 55.25,79.37 54.93,79.69 54.93,83.35 Q8.1
N$4
  Top 1.27: Q5.3 81.28,74.47 81.28,72.07 85.72,72.07 85.72,73.98 | Q3.3 85.72,74.47 85.72,73.98 | 86.36,73.66 86.04,73.98 85.72,73.98
  Top 2.54: STR_3-12V.2 86.36,73.7 86.36,73.66
N$5
  Top 1.27: Q35.3 81.28,59.23 81.28,56.83 85.72,56.83 85.72,57.15 85.72,59.23 Q34.3
  Top 2.54: STR-4-12V.2 92.99,59.37 88.9,59.37 86.68,57.15 85.72,57.15
N$6
  Top 1.27: Q14.3 45.89,81.6 48.26,81.6 48.26,85.72 47.94,85.72 45.87,85.72 Q13.3
  Top 2.54: STR-2-GND.3 45.6,89.97 47.94,87.63 47.94,85.72
N$7
  Top 1.27: Q7.3 56.37,81.6 58.74,81.6 58.74,85.72 56.34,85.72 Q8.3
  Top 2.54: STR-1-GND.2 61.55,90.13 58.74,87.31 58.74,85.72
N$8
  Top 0.406: Q9.3 50.17,75.39 R10.1 Q11.1 50.17,79.37 49.85,79.69 49.85,83.35 Q10.1
N$9
  Top 0.406: Q15.3 39.69,75.39 R14.1 Q17.1 39.69,79.37 39.37,79.69 39.37,83.35 Q16.1
N$10
  Top 1.27: Q11.3 51.29,81.6 53.66,81.6 53.66,85.72 51.27,85.72 Q10.3
  Top 2.54: STR-1-GND.1 56.55,90.53 53.66,87.63 53.66,85.72
N$11
  Top 1.27: Q17.3 40.81,81.6 43.18,81.6 43.18,86.04 42.86,86.04 40.81,86.04 Q16.3
  Top 2.54: STR-2-GND.2 40.6,90.21 42.86,87.95 42.86,86.04
N$12
  Top 0.406: Q18.3 34.61,75.39 R16.1 Q20.1 34.61,79.37 34.29,79.69 34.29,83.35 Q19.1
N$13
  Top 1.27: Q20.3 35.73,81.6 38.1,81.6 38.1,86.04 37.78,86.04 35.73,86.04 Q19.3
  Top 2.54: STR-2-GND.1 35.6,89.81 37.78,87.63 37.78,86.04
N$14
  Top 0.406: Q21.3 29.53,75.39 R18.1 Q23.1 29.53,79.37 29.21,79.69 29.21,83.35 Q22.1
N$15
  Top 1.27: Q23.3 30.65,81.6 33.02,81.6 33.02,86.04 31.43,86.04 | Q22.3 30.65,86.04 31.43,86.04 | 31.11,86.68 31.43,86.36 31.43,86.04
  Top 2.54: STR-3-GND.3 30.04,87.63 30.16,87.63 31.11,86.68
N$16
  Top 0.406: Q24.3 24.45,75.39 R20.1 Q26.1 24.45,79.37 24.13,79.69 24.13,83.35 Q25.1
N$17
  Top 1.27: Q26.3 25.57,81.6 27.94,81.6 27.94,86.04 26.04,86.04 | Q25.3 25.57,86.04 26.04,86.04 | 26.04,86.68 26.04,86.04
  Top 2.54: STR-3-GND.2 26,86.68 26.04,86.68
N$18
  Top 0.406: Q27.3 19.37,75.39 R22.1 Q28.1 19.37,79.37 19.05,79.69 19.05,83.35 Q29.1
N$19
  Top 1.27: Q28.3 20.49,81.6 22.86,81.6 22.86,86.04 20.95,86.04 | Q29.3 20.49,86.04 20.95,86.04 | 20.95,86.68 20.95,86.04
  Top 2.54: STR-3-GND.1 20.95,86.72 20.95,86.68
N$20
  Top 1.27: Q31.3 81.28,69.39 81.28,66.99 85.72,66.99 85.72,68.9 | Q30.3 85.72,69.39 85.72,68.9 | 86.36,68.58 85.72,68.9
  Top 2.54: STR_3-12V.3 87.95,70.29 87.95,70.17 86.36,68.58
N$21
  Top 1.27: Q37.3 81.28,54.15 81.28,51.75 85.72,51.75 85.72,52.07 85.72,54.15 Q36.3
  Top 2.54: STR-4-12V.3 92.91,54.29 88.9,54.29 86.68,52.07 85.72,52.07
N$22
  Top 1.27: Q33.3 81.28,64.31 81.28,61.91 85.72,61.91 85.72,62.23 85.72,64.31 Q32.3
  Top 2.54: STR_3-12V.4 88.58,65.92 88.58,64.77 86.04,62.23 85.72,62.23
N$23
  Top 1.27: Q39.3 81.28,49.06 81.28,46.67 85.72,46.67 85.72,49.06 Q38.3
  Top 2.54: STR-4-12V.4 92.83,49.21 89.53,49.21 87,46.67 85.72,46.67
N$24
  Top 1.27: Q41.3 81.28,43.98 81.28,41.59 85.72,41.59 85.72,43.98 Q40.3
  Top 2.54: 85.72,41.59 88.27,41.59 91.08,38.77 STR-5-12V.2
N$25
  Top 1.27: Q43.3 81.28,38.91 81.28,36.51 85.72,36.51 85.72,38.91 Q42.3
  Top 2.54: 85.72,36.51 87.95,36.51 90.69,33.77 STR-5-12V.3
N$26
  Top 1.27: Q44.3 85.72,33.97 85.72,31.43 81.28,31.43 81.28,33.97 Q45.3
  Top 2.54: 85.72,31.43 88.38,28.77 STR-5-12V.4
N$27
  Top 0.406: U1.6 50.21,62.24 52.49,64.51 56.71,64.51 58.17,65.97 60.29,65.97 R31.2
N$28
  Top 0.406: U1.7 49.56,62.56 52.98,65.97 55.09,65.97 R32.2
N$29
  Top 0.406: U1.21 48.91,41.76 49.08,41.92 66.46,41.92 72.15,36.24 72.15,34.94 R45.2
N$30
  Top 0.406: R44.2 72.15,40.14 72.15,40.3 69.06,40.3 66.79,42.58 48.75,42.58 48.26,42.09 U1.20
N$31
  Top 0.406: U1.19 47.61,42.41 48.42,43.23 71.66,43.23 72.15,43.71 72.15,45.01 R43.2
N$32
  Top 0.406: U1.18 46.96,42.74 48.1,43.88 67.6,43.88 72.15,48.42 72.15,50.05 R42.2
N$33
  Top 0.406: U1.17 46.31,43.06 47.77,44.52 67.28,44.52 70.69,47.94 70.69,51.51 72.15,52.98 72.15,55.09 R41.2
N$34
  Top 0.406: U1.16 45.66,43.39 47.45,45.17 66.95,45.17 70.04,48.26 70.04,51.84 70.69,52.49 70.69,56.71 72.15,58.17 72.15,60.29 R40.2
N$35
  Top 0.406: U1.15 45.01,42.58 44.04,43.55 44.04,47.61 45.01,48.59 45.01,58.5 40.95,62.56 32.34,62.56 31.36,63.54 27.79,63.54 27.14,64.19 23.07,64.19 21.61,65.65 19.5,65.65 R39.2
N$36
  Top 0.406: U1.13 45.66,58.83 41.27,63.21 32.66,63.21 31.69,64.19 28.11,64.19 26.65,65.65 24.54,65.65 R38.2
N$37
  Top 0.406: U1.12 46.31,59.15 41.6,63.86 32.99,63.86 31.2,65.65 29.57,65.65 R37.2
N$38
  Top 0.406: 34.61,65.65 R36.2 34.77,65.65 36.24,65.65 37.38,64.51 41.92,64.51 46.96,59.48 U1.11
N$39
  Top 0.406: 39.65,65.97 R35.2 39.81,65.97 41.44,65.97 47.61,59.8 U1.10
N$40
  Top 0.406: 44.69,65.97 R34.2 | 44.85,65.97 R34.2 | U1.9 48.26,64.19 46.48,65.97 45.01,65.97 R34.2
N$41
  Top 0.406: U1.8 48.91,65.81 49.08,65.97 49.89,65.97 R33.2 50.05,65.97
N$42  (via drill 0.5)
  Top 0.406: R46.2 51.67,35.1 51.84,34.94 51.84,27.62 49.24,25.02 45.99,25.02 v45.34,25.68
  Bottom 0.406: v45.34,25.68 45.01,25.68 44.52,25.19 39.65,25.19 37.21,22.75 35.75,22.75 WEMOS1.D1
N$43  (via drill 0.5)
  Top 0.406: R47.2 53.66,33.02 53.66,28.48 49.56,24.38 45.34,24.38 v45.17,24.54
  Bottom 0.406: v45.17,24.54 39.98,24.54 35.75,20.31 WEMOS1.D2
N$115
  Top 0.406: Q4.3 60.33,75.39 R106.1 Q2.1 60.33,79.37 60.01,79.69 60.01,83.35 Q1.1
SCL
  Top 0.406: R46.1 51.75,37.15 52.16,37.56 U1.26
SDA
  Top 0.406: R47.1 53.66,37.15 52.81,37.99 U1.27
STR-1_B
  Top 0.406: Q9.1 50.16,72.39 50.17,72.39 R9.2 50.21,70.04 50.21,68.09 R33.1
STR-1_G
  Top 0.406: Q6.1 R6.2 55.25,70.04 55.25,68.09 R32.1
STR-1_R
  Top 0.406: Q4.1 R105.2 60.29,70.04 60.29,68.09 R31.1
STR-2_B
  Top 0.406: Q18.1 R15.2 34.61,70.04 34.61,67.76 R36.1
STR-2_G
  Top 0.406: Q15.1 R13.2 39.65,70.04 39.65,68.09 R35.1
STR-2_R
  Top 0.406: Q12.1 R11.2 44.85,70.04 44.85,68.09 R34.1
STR-3_B  (via drill 0.5)
  Top 0.406: Q32.1 83.5,65.57 83.5,65.72 79.69,65.72 79.37,65.4 Q33.1 R24.2 77.03,65.33 62.56,65.33 61.75,64.51 57.69,64.51 57.04,63.86 52.81,63.86 51.51,62.56 v51.51,62.24 | Q27.1 R21.2 19.34,70.04 19.34,67.76 R39.1 19.5,67.6 v21.12,67.6
  Bottom 0.406: v51.51,62.24 26.49,62.24 v21.12,67.6
STR-3_G  (via drill 0.5)
  Top 0.406: Q30.1 83.35,70.8 79.69,70.8 79.37,70.48 Q31.1 R23.2 77.03,70.53 v63.7,70.53 | Q24.1 R19.2 24.38,70.04 24.38,67.76 R38.1 24.54,67.6 v26.16,67.6
  Bottom 0.406: v63.7,70.53 29.09,70.53 v26.16,67.6
STR-3_R  (via drill 0.5)
  Top 0.406: Q3.1 83.35,75.88 79.69,75.88 79.37,75.56 Q5.1 R7.2 74.61,75.56 72.71,73.66 v64.14,73.66 | R17.2 Q21.1 29.53,72.39 29.53,73.03 v28.89,73.66 | 29.59,69.98 R17.2 | 29.59,69.85 R17.2 | 29.78,69.92 R17.2 | R17.2 29.57,69.71 29.57,67.76 R37.1
  Bottom 0.406: v28.89,73.66 v64.14,73.66
STR-4_B
  Top 0.406: Q38.1 83.35,50.48 79.69,50.48 79.37,50.16 Q39.1 R27.2 77.03,50.21 74.1,50.21 R42.1
STR-4_G
  Top 0.406: Q36.1 83.35,55.56 79.69,55.56 79.37,55.24 Q37.1 R26.2 77.03,55.25 74.1,55.25 R41.1
STR-4_R
  Top 0.406: Q34.1 83.5,60.49 83.5,60.64 79.69,60.64 79.37,60.32 Q35.1 R25.2 77.03,60.29 74.1,60.29 R40.1
STR-5_B
  Top 0.406: Q44.1 83.35,35.24 79.69,35.24 79.37,34.92 Q45.1 R30.2 77.03,34.94 74.1,34.94 R45.1
STR-5_G
  Top 0.406: Q42.1 83.35,40.32 79.69,40.32 79.37,40 Q43.1 R29.2 77.03,39.98 74.1,39.98 R44.1
STR-5_R
  Top 0.406: Q40.1 83.35,45.4 79.69,45.4 79.37,45.08 Q41.1 R28.2 77.03,45.01 75.4,45.01 75.24,45.17 74.1,45.17 R43.1
SW1
  Bottom 0.406: R2.2 6.67,37.15 6.99,36.83 8.57,36.83 S2.D 8.89,36.51 11.11,34.29 11.11,24.13 12.7,22.54 WEMOS1.D0
SW2
  Bottom 0.406: R3.2 6.67,28.57 6.99,28.26 8.57,28.26 S3.D 8.89,27.94 10.16,26.67 10.16,20.64 13.02,17.78 WEMOS1.D6
SW3
  Bottom 0.406: R4.2 6.99,20 7.3,19.68 8.57,19.68 S4.D 8.57,19.37 12.7,15.24 WEMOS1.D7
SW4
  Bottom 0.406: R5.2 6.99,11.43 7.3,11.11 8.57,11.11 S5.D 8.89,11.11 11.43,11.11 12.7,12.38 WEMOS1.D8
WS2812_DATA  (via drill 0.5)
  Top 0.406: WEMOS1.D5 12.95,20.19 13.46,20.19 32.38,1.27 77.79,1.27 v79.38,2.86 | v91.12,14.61 93.03,16.19 WS2812.2
  Bottom 0.406: v79.38,2.86 v91.12,14.61